# EAGLE schematic teensy_connector_smt_print (EAGLE 7.5.0)
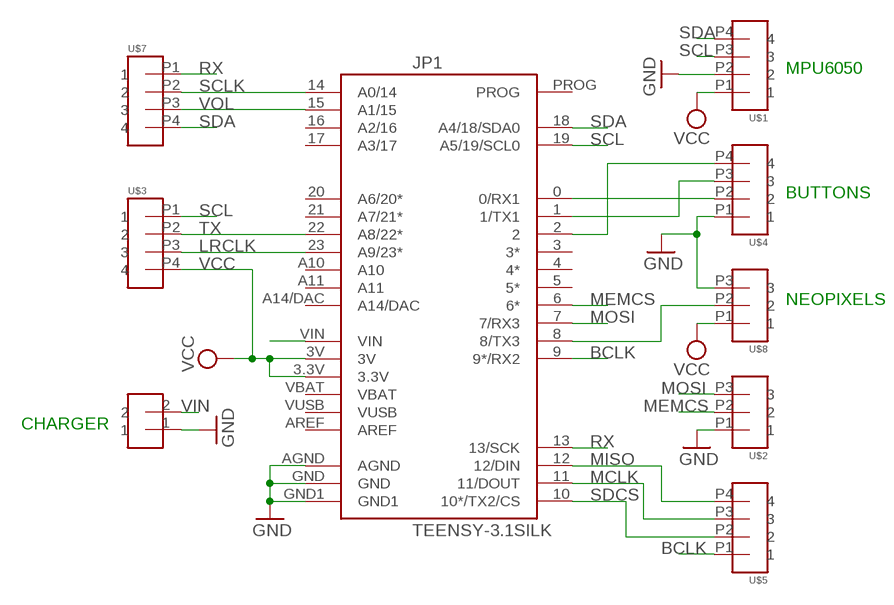
[diagram p0: schematic, sheet 1]

## Parts
JP1  TEENSY-3.1SILK  [TEENSY-3.1]
U$1  PTSM0,4-HH-2,5-SMD-R44  [M04_SMD_RIGHT]
U$2  PTSM0,3-HH-2,5-SMD-R44  [M03_SMD_RIGHT]
U$3  PTSM0,4-HH-2,5-SMD-R44  [M04_SMD_RIGHT]
U$4  PTSM0,4-HH-2,5-SMD-R44  [M04_SMD_RIGHT]
U$5  PTSM0,4-HH-2,5-SMD-R44  [M04_SMD_RIGHT]
U$6  HEADER-2  [HEADER-2]
U$7  PTSM0,4-HH-2,5-SMD-R44  [M04_SMD_RIGHT]
U$8  PTSM0,3-HH-2,5-SMD-R44  [M03_SMD_RIGHT]

## Nets
BCLK: JP1.9(9*/RX2) U$5.P1
GND: JP1.AGND JP1.GND JP1.GND1 U$1.P2 U$2.P1 U$4.P1 U$6.1 U$8.P3
LRCLK: JP1.23(A9/23*) U$3.P3
MCLK: JP1.11(11/DOUT) U$5.P3
MEMCS: JP1.6(6*) U$2.P2
MISO: JP1.12(12/DIN) U$5.P4
MOSI: JP1.7(7/RX3) U$2.P3
N$1: JP1.1(1/TX1) U$4.P3
N$2: JP1.0(0/RX1) U$4.P2
N$3: JP1.8(8/TX3) U$8.P2
N$4: JP1.2 U$4.P4
RX: JP1.13(13/SCK) U$7.P1
SCL: JP1.19(A5/19/SCL0) U$1.P3 U$3.P1
SCLK: JP1.14(A0/14) U$7.P2
SDA: JP1.18(A4/18/SDA0) U$1.P4 U$7.P4
SDCS: JP1.10(10*/TX2/CS) U$5.P2
TX: JP1.22(A8/22*) U$3.P2
VCC: JP1.3.3V JP1.3V U$1.P1 U$3.P4 U$8.P1
VIN: JP1.VIN U$6.2
VOL: JP1.15(A1/15) U$7.P3
Unconnected: JP1.3(3*) JP1.4(4*) JP1.5(5*) JP1.16(A2/16) JP1.17(A3/17) JP1.20(A6/20*) JP1.21(A7/21*) JP1.A10 JP1.A11 JP1.A14/DAC JP1.AREF JP1.PROG JP1.VBAT JP1.VUSB

## Notes on the sheet
- MPU6050
- BUTTONS
- NEOPIXELS
- CHARGER

## Library data of the parts
JP1 = SparkFun-Boards:TEENSY-3.1; SF_ID: DEV-12646
U$1 U$3-U$5 U$7 = PTSM_Connector:PTSM0,4-HH-2,5-SMD-R44
U$2 U$8 = PTSM_Connector:PTSM0,3-HH-2,5-SMD-R44
U$6 = homemade-hardware:HEADER-2